# EAGLE schematic Sewable-Connector-V1 (EAGLE 9.3.2)
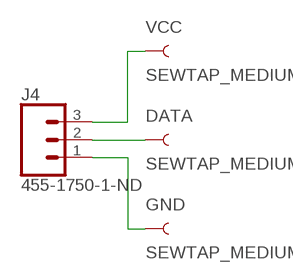
[diagram p0: schematic, sheet 1]

## Parts
DATA  SEWTAP_MEDIUM  [PETAL-MEDIUM]
GND  SEWTAP_MEDIUM  [PETAL-MEDIUM]
J4  455-1750-1-ND  CONN_03  [1X03]
VCC  SEWTAP_MEDIUM  [PETAL-MEDIUM]

## Nets
N$1: J4.3 VCC.1
N$2: DATA.1 J4.2
N$3: GND.1 J4.1

## Library data of the parts
DATA GND VCC = LilyPad-Wearables:SEWTAP: SparkFun LilyPad Sew Taps Sewable connection points for LilyPad Boards SparkFun Products: LilyPad Arduino 328 Main Board <https://www.sparkfun.com/products/13342> LilyTiny <https://www.sparkfun.com/products/10899> LilyPad Power Supply <https://www.sparkfun.com/products/11259>
J4 = SparkFun-Connectors:CONN_03: Multi connection point. Often used as Generic Header-pin footprint for 0.1 inch spaced/style header connections On any of the 0.1 inch spaced packages, you can populate with these: Break Away Headers - Straight <https://www.sparkfun.com/products/116> (PRT-00116) Break Away Male Headers - Right Angle <https://www.sparkfun.com/products/553> (PRT-00553) Female Headers <https://www.sparkfun.com/products/115> (PRT-00115) Break Away Headers - Machine Pin <https://www.sparkfun.com/products/117> (PRT-00117) Break Away Female Headers - Swiss Machine Pin <https://www.sparkfun.com/products/743> (PRT-00743) Stackable Header - 3 Pin (Female, 0.1") <https://www.sparkfun.com/products/13875> (PRT-13875) For SCREWTERMINALS and SPRING TERMINALS visit here: Screw Terimnals on SparkFun.com <https://www.sparkfun.com/search/results?term=Screw+Terminals> (5mm/3.5mm/2.54mm spacing) This device is also useful as a general connection point to wire up your design to another part of your project. Our various solder wires solder well into these plated through hole pads. Hook-Up Wire - Assortment (Stranded, 22 AWG) <https://www.sparkfun.com/products/11375> (PRT-11375) Hook-Up Wire - Assortment (Solid Core, 22 AWG) <https://www.sparkfun.com/products/11367> (PRT-11367) View the entire wire category on our website here <https://www.sparkfun.com/categories/141> Special notes: Molex polarized connector foot print use with SKU : PRT-08232 with associated crimp pins and housings.; PROD_ID: XXX-00000